# EAGLE schematic Helepolis_Level0 (EAGLE 6.4)
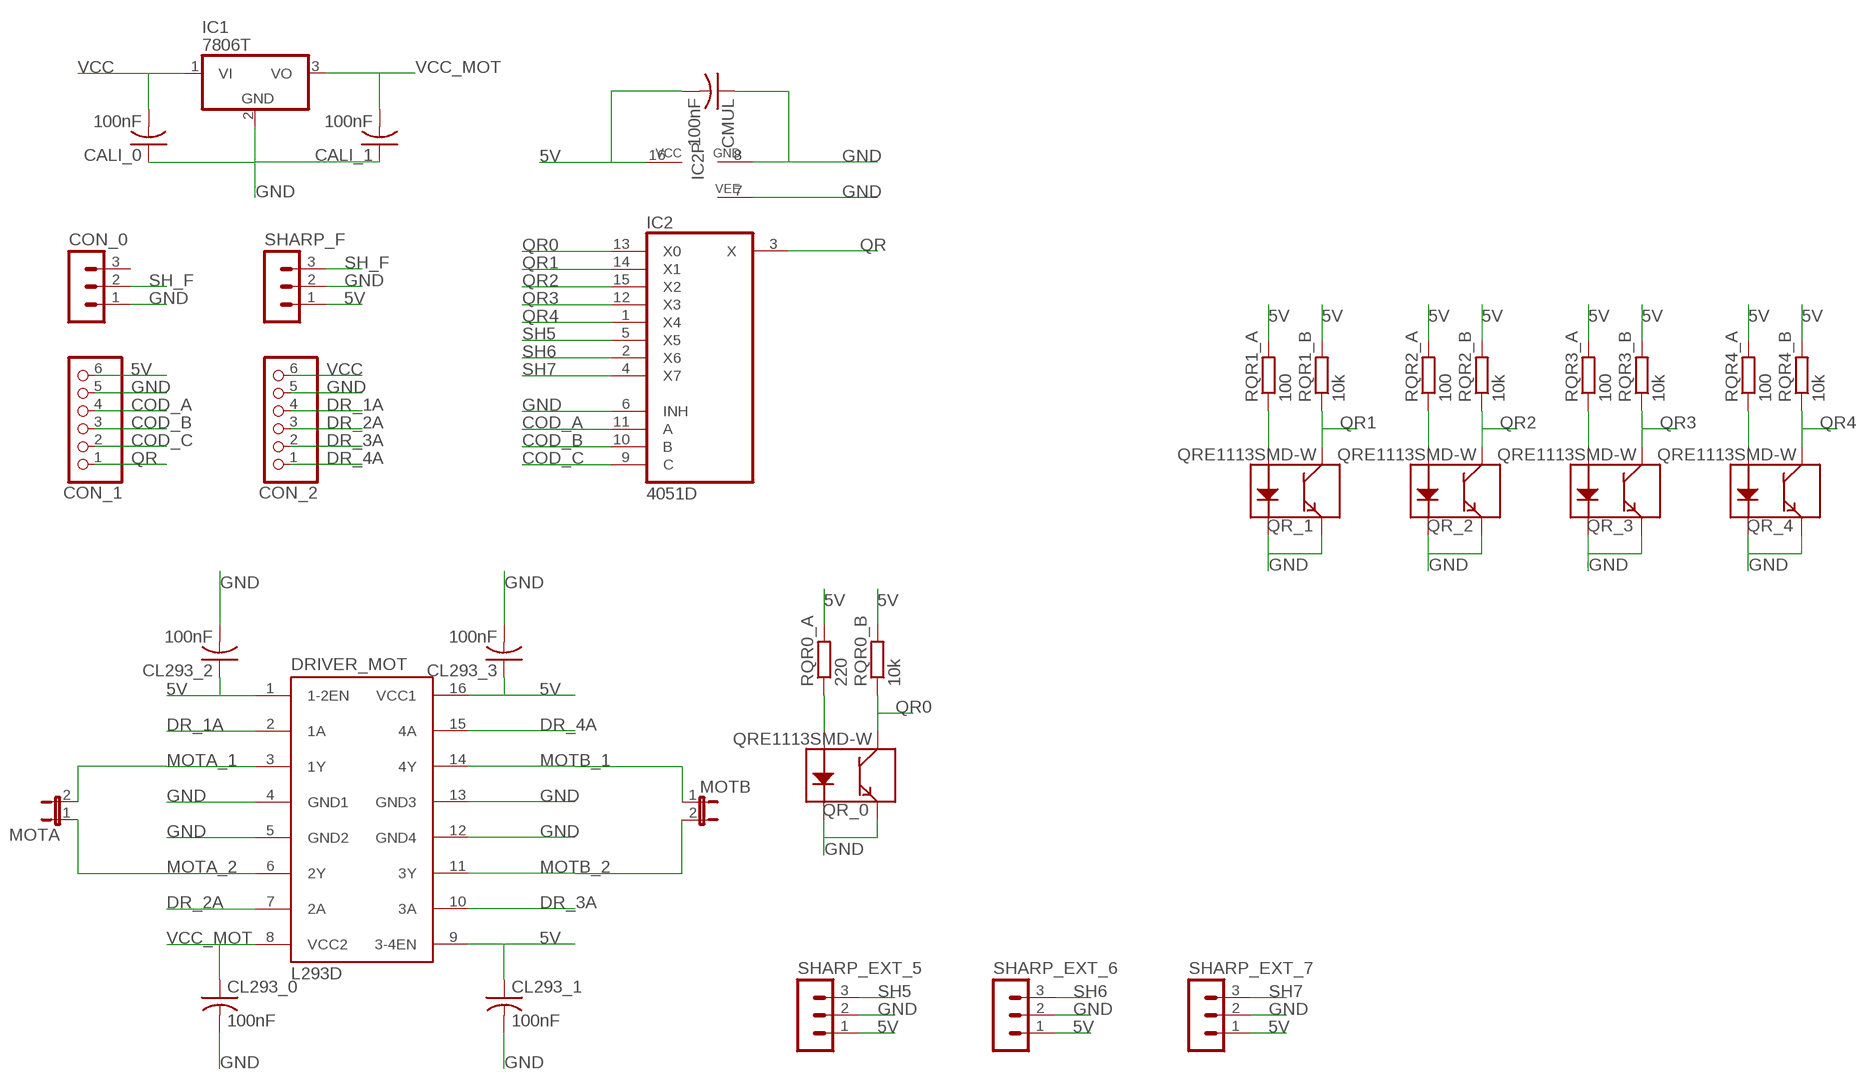
[diagram p0: schematic, sheet 1]

## Parts
CALI_0  100nF  C-USC1206  [C1206]
CALI_1  100nF  C-USC1206  [C1206]
CL293_0  100nF  C-USC1206  [C1206]
CL293_1  100nF  C-USC1206  [C1206]
CL293_2  100nF  C-USC1206  [C1206]
CL293_3  100nF  C-USC1206  [C1206]
CMUL  100nF  C-USC1206  [C1206]
CON_0  MA03-1  [MA03-1]
CON_1  PINHD-1X6  [1X06]
CON_2  PINHD-1X6  [1X06]
DRIVER_MOT  L293D  [DIL16]
IC1  7806T  [TO220H]
IC2  4051D  [SO16]
MOTA  JP1E  [JP1]
MOTB  JP1E  [JP1]
QR_0  QRE1113SMD-W  [QRE1113-W]
QR_1  QRE1113SMD-W  [QRE1113-W]
QR_2  QRE1113SMD-W  [QRE1113-W]
QR_3  QRE1113SMD-W  [QRE1113-W]
QR_4  QRE1113SMD-W  [QRE1113-W]
RQR0_A  220  R-EU_R1206  [R1206]
RQR0_B  10k  R-EU_R1206  [R1206]
RQR1_A  100  R-EU_R1206  [R1206]
RQR1_B  10k  R-EU_R1206  [R1206]
RQR2_A  100  R-EU_R1206  [R1206]
RQR2_B  10k  R-EU_R1206  [R1206]
RQR3_A  100  R-EU_R1206  [R1206]
RQR3_B  10k  R-EU_R1206  [R1206]
RQR4_A  100  R-EU_R1206  [R1206]
RQR4_B  10k  R-EU_R1206  [R1206]
SHARP_EXT_5  MA03-1  [MA03-1]
SHARP_EXT_6  MA03-1  [MA03-1]
SHARP_EXT_7  MA03-1  [MA03-1]
SHARP_F  MA03-1  [MA03-1]

## Nets
5V [VCC]: CL293_1.1 CL293_2.1 CL293_3.1 CMUL.2 CON_1.6 DRIVER_MOT.1(1-2EN) DRIVER_MOT.9(3-4EN) DRIVER_MOT.16(VCC1) IC2.16(VCC) RQR0_A.2 RQR0_B.2 RQR1_A.2 RQR1_B.2 RQR2_A.2 RQR2_B.2 RQR3_A.2 RQR3_B.2 RQR4_A.2 RQR4_B.2 SHARP_EXT_5.1 SHARP_EXT_6.1 SHARP_EXT_7.1 SHARP_F.1
COD_A: CON_1.4 IC2.11(A)
COD_B: CON_1.3 IC2.10(B)
COD_C: CON_1.2 IC2.9(C)
DR_1A: CON_2.4 DRIVER_MOT.2(1A)
DR_2A: CON_2.3 DRIVER_MOT.7(2A)
DR_3A: CON_2.2 DRIVER_MOT.10(3A)
DR_4A: CON_2.1 DRIVER_MOT.15(4A)
GND [VCC]: CALI_0.1 CALI_1.1 CL293_0.2 CL293_1.2 CL293_2.2 CL293_3.2 CMUL.1 CON_0.1 CON_1.5 CON_2.5 DRIVER_MOT.4(GND1) DRIVER_MOT.5(GND2) DRIVER_MOT.12(GND4) DRIVER_MOT.13(GND3) IC1.2(GND) IC2.6(INH) IC2.7(VEE) IC2.8(GND) QR_0.2(K) QR_0.4(E) QR_1.2(K) QR_1.4(E) QR_2.2(K) QR_2.4(E) QR_3.2(K) QR_3.4(E) QR_4.2(K) QR_4.4(E) SHARP_EXT_5.2 SHARP_EXT_6.2 SHARP_EXT_7.2 SHARP_F.2
MOTA_1 [VCC]: DRIVER_MOT.3(1Y) MOTA.2
MOTA_2 [VCC]: DRIVER_MOT.6(2Y) MOTA.1
MOTB_1 [VCC]: DRIVER_MOT.14(4Y) MOTB.1
MOTB_2 [VCC]: DRIVER_MOT.11(3Y) MOTB.2
N$1: QR_0.1(A) RQR0_A.1
N$2: QR_1.1(A) RQR1_A.1
N$4: QR_2.1(A) RQR2_A.1
N$5: QR_3.1(A) RQR3_A.1
N$6: QR_4.1(A) RQR4_A.1
QR: CON_1.1 IC2.3(X)
QR0: IC2.13(X0) QR_0.3(C) RQR0_B.1
QR1: IC2.14(X1) QR_1.3(C) RQR1_B.1
QR2: IC2.15(X2) QR_2.3(C) RQR2_B.1
QR3: IC2.12(X3) QR_3.3(C) RQR3_B.1
QR4: IC2.1(X4) QR_4.3(C) RQR4_B.1
SH5: IC2.5(X5) SHARP_EXT_5.3
SH6: IC2.2(X6) SHARP_EXT_6.3
SH7: IC2.4(X7) SHARP_EXT_7.3
SH_F: CON_0.2 SHARP_F.3
VCC [VCC]: CALI_0.2 CON_2.6 IC1.1(VI)
VCC_MOT [VCC]: CALI_1.2 CL293_0.1 DRIVER_MOT.8(VCC2) IC1.3(VO)
Unconnected: CON_0.3

## Library data of the parts
CALI_0 CALI_1 CL293_0 CL293_1-CL293_3 CMUL = adafruit:C-US: CAPACITOR, American symbol
CON_0 SHARP_EXT_5-SHARP_EXT_7 SHARP_F = con-lstb:MA03-1: PIN HEADER; OC_FARNELL: unknown; OC_NEWARK: unknown
CON_1 CON_2 = pinhead:PINHD-1X6: PIN HEADER
DRIVER_MOT = st-microelectronics:L293D: PUSH-PULL 4 CHANNEL DRIVER; MPN: L293D; OC_FARNELL: 9589619; OC_NEWARK: 56P8249
IC1 = linear:78*: Positive VOLTAGE REGULATOR Source: http://cache.national.com/ds/LM/LM78L05.pdf http://www.fairchildsemi.com/ds/LM/LM7805.pdf
IC2 = 40xx:4051: 8-channel ANALOG MULTIPLEXER
MOTA MOTB = jumper:JP1E: JUMPER
QR_0 QR_1-QR_4 = SparkFun-Sensors:QRE1113: Reflective object sensor
RQR0_A RQR0_B RQR1_A RQR1_B RQR2_A RQR2_B RQR3_A RQR3_B RQR4_A RQR4_B = rcl:R-EU_: RESISTOR, European symbol

## Net classes
1 GND: width 1.016 mm, clearance 0.305 mm
2 VCC: width 0.635 mm, clearance 0.305 mm to class 1